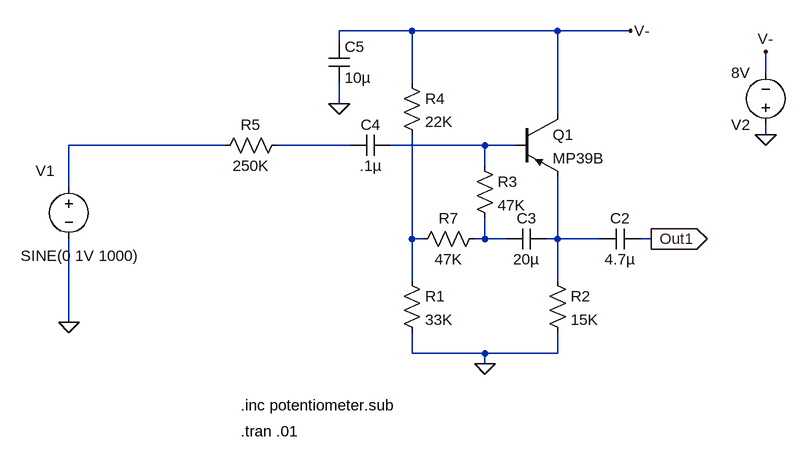
[diagram p0: schematic bootstrapped-buffer-mp39b.asc]
bootstrapped-buffer-mp39b.asc, the LTspice schematic file:
Version 4
SHEET 1 880 680
WIRE -1184 -768 -1296 -768
WIRE -960 -768 -1184 -768
WIRE -848 -768 -960 -768
WIRE -1296 -752 -1296 -768
WIRE -640 -704 -640 -736
WIRE -1184 -688 -1184 -768
WIRE -1296 -656 -1296 -688
WIRE -960 -640 -960 -768
WIRE -640 -608 -640 -624
WIRE -1472 -592 -1712 -592
WIRE -1280 -592 -1392 -592
WIRE -1072 -592 -1216 -592
WIRE -1024 -592 -1072 -592
WIRE -1072 -560 -1072 -592
WIRE -1712 -528 -1712 -592
WIRE -1184 -448 -1184 -608
WIRE -1168 -448 -1184 -448
WIRE -1072 -448 -1072 -480
WIRE -1072 -448 -1088 -448
WIRE -1040 -448 -1072 -448
WIRE -960 -448 -960 -544
WIRE -960 -448 -976 -448
WIRE -896 -448 -960 -448
WIRE -816 -448 -832 -448
WIRE -1184 -384 -1184 -448
WIRE -960 -384 -960 -448
WIRE -1712 -320 -1712 -448
WIRE -1184 -272 -1184 -304
WIRE -1072 -272 -1184 -272
WIRE -960 -272 -960 -304
WIRE -960 -272 -1072 -272
WIRE -1072 -256 -1072 -272
FLAG -1712 -320 0
FLAG -640 -608 0
FLAG -640 -736 V-
FLAG -1072 -256 0
FLAG -848 -768 V-
FLAG -816 -448 Out1
IOPIN -816 -448 Out
FLAG -1296 -656 0
SYMBOL voltage -1712 -544 R0
WINDOW 39 -112 95 Left 2
WINDOW 3 -74 122 Left 2
WINDOW 0 -51 -9 Left 2
SYMATTR Value SINE(0 1V 1000)
SYMATTR InstName V1
SYMATTR Value2 AC 1
SYMBOL voltage -640 -608 R180
WINDOW 123 0 0 Left 2
WINDOW 39 0 0 Left 2
SYMATTR InstName V2
SYMATTR Value 8V
SYMBOL pnp -1024 -640 R0
SYMATTR InstName Q1
SYMATTR Value MP39B
SYMBOL res -1200 -400 R0
SYMATTR InstName R1
SYMATTR Value 33K
SYMBOL res -1072 -464 R90
WINDOW 0 0 56 VBottom 2
WINDOW 3 32 56 VTop 2
SYMATTR InstName R7
SYMATTR Value 47K
SYMBOL cap -832 -464 R90
WINDOW 0 0 32 VBottom 2
WINDOW 3 32 32 VTop 2
SYMATTR InstName C2
SYMATTR Value 4.7µ
SYMBOL cap -1312 -752 R0
SYMATTR InstName C5
SYMATTR Value 10µ
SYMBOL res -976 -400 R0
SYMATTR InstName R2
SYMATTR Value 15K
SYMBOL cap -976 -464 R90
WINDOW 0 0 32 VBottom 2
WINDOW 3 32 32 VTop 2
SYMATTR InstName C3
SYMATTR Value 20µ
SYMBOL res -1088 -576 R0
SYMATTR InstName R3
SYMATTR Value 47K
SYMBOL res -1200 -704 R0
SYMATTR InstName R4
SYMATTR Value 22K
SYMBOL cap -1216 -608 R90
WINDOW 0 0 32 VBottom 2
WINDOW 3 32 32 VTop 2
SYMATTR InstName C4
SYMATTR Value .1µ
SYMBOL res -1376 -608 R90
WINDOW 0 0 56 VBottom 2
WINDOW 3 32 56 VTop 2
SYMATTR InstName R5
SYMATTR Value 250K
TEXT -1448 -152 Left 2 !.tran .01
TEXT -1448 -192 Left 2 !.inc potentiometer.sub

The netlist it stands for:
* bootstrapped-buffer-mp39b.asc
V1 N001 0 SINE(0 1V 1000) AC 1
V2 0 V- 8V
Q1 V- N003 N006 0 MP39B
R1 N004 0 33K
R7 N005 N004 47K
C2 Out1 N006 4.7µ
C5 V- 0 10µ
R2 N006 0 15K
C3 N006 N005 20µ
R3 N003 N005 47K
R4 V- N004 22K
C4 N003 N002 .1µ
R5 N002 N001 250K
.model NPN NPN
.model PNP PNP
.lib standard.bjt
.tran .01
.inc potentiometer.sub
.backanno
.end